# Altium schematic sheet Sheet_CL-IR-01.SchDoc: Inverter / Rectifier
size A4; Author: Canaan Lv; DocumentNumber: CL-IR-01; Revision: 1.0v
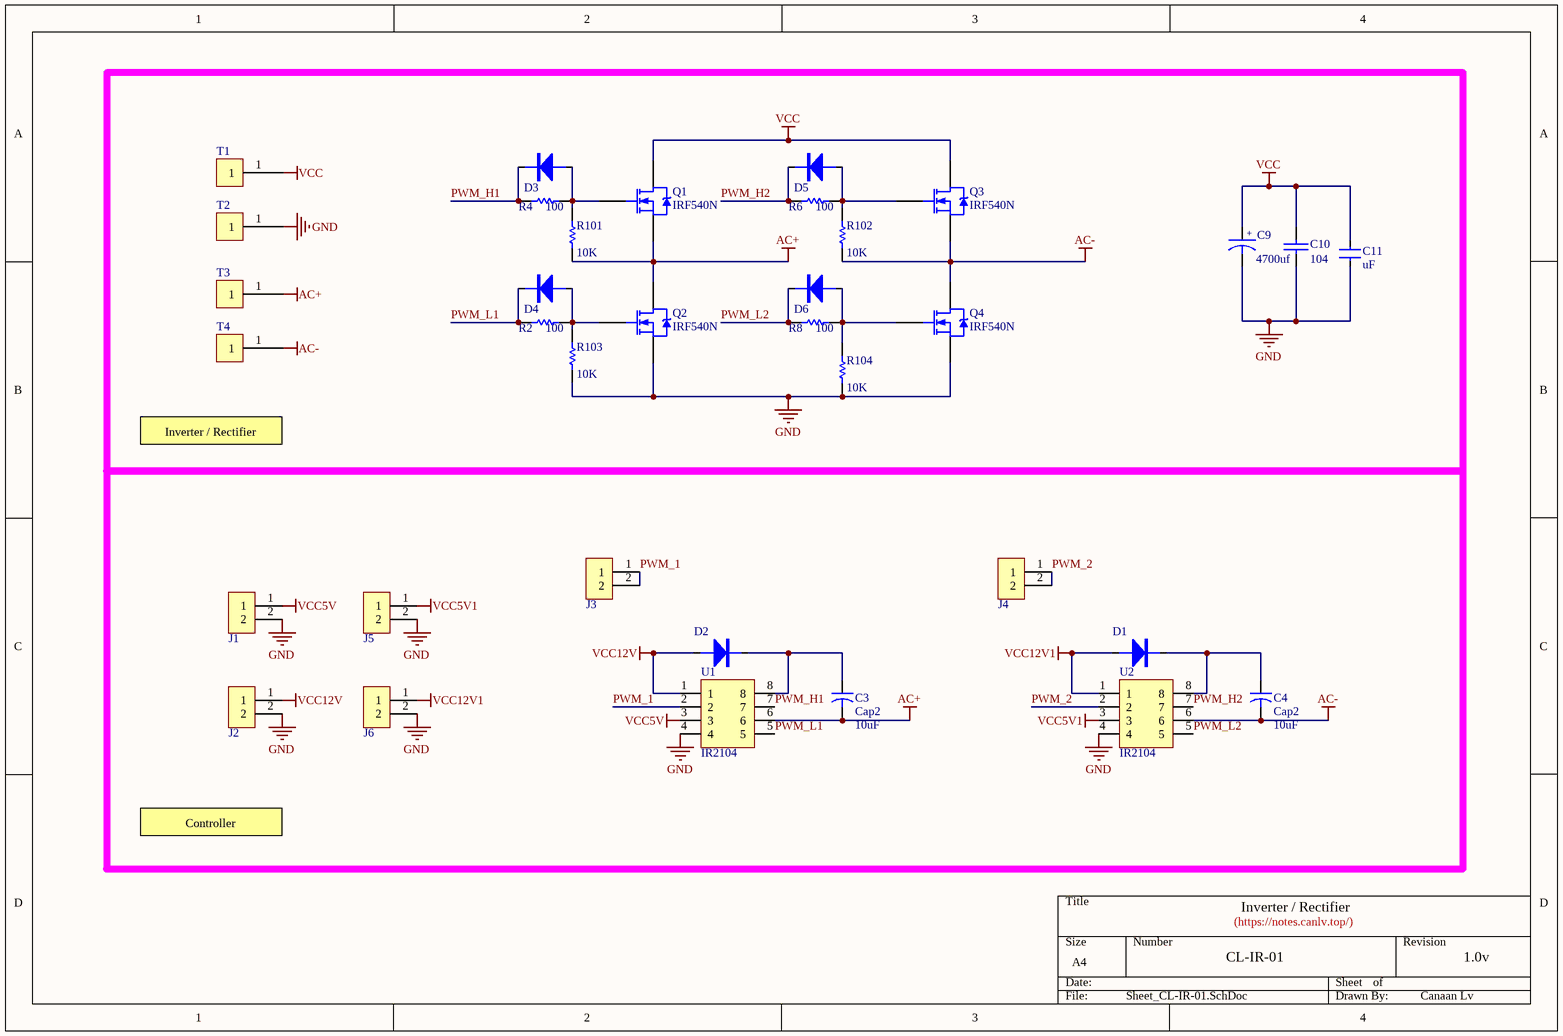
[diagram p0: Sheet_CL-IR-01.SchDoc]

## Parts
C3  Cap2  value 10uF  [CZ0.50/25V47U]
C4  Cap2  value 10uF  [CZ0.50/25V47U]
C9  电解电容  [CZ16X25]  (value not drawn)
C10  普通电容  [C1206]  (value not drawn)
C11  uF  [C0.254]
D1  DO-41  [DO-41-2]  (value not drawn)
D2  DO-41  [DO-41-2]  (value not drawn)
D3  0805D  [0805D]  (value not drawn)
D4  0805D  [0805D]  (value not drawn)
D5  0805D  [0805D]  (value not drawn)
D6  0805D  [0805D]  (value not drawn)
J1  SIP-2  [2.54XH接插件2P]  (value not drawn)
J2  SIP-2  [2.54XH接插件2P]  (value not drawn)
J3  SIP-2  [2.54XH接插件2P]  (value not drawn)
J4  SIP-2  [2.54XH接插件2P]  (value not drawn)
J5  SIP-2  [2.54XH接插件2P]  (value not drawn)
J6  SIP-2  [2.54XH接插件2P]  (value not drawn)
Q1  IRF540N  [TO-220AB]
Q2  IRF540N  [TO-220AB]
Q3  IRF540N  [TO-220AB]
Q4  IRF540N  [TO-220AB]
R2  value 100  [R1206]
R4  value 100  [R1206]
R6  value 100  [R1206]
R8  value 100  [R1206]
R101  value 10K  [R1206]
R102  value 10K  [R1206]
R103  value 10K  [R1206]
R104  value 10K  [R1206]
T1  (no value)  [香蕉接线柱Red_6mm]
T2  (no value)  [香蕉接线柱Red_6mm]
T3  (no value)  [香蕉接线柱Red_6mm]
T4  (no value)  [香蕉接线柱Red_6mm]
U1  IR2104  [SOP8]
U2  IR2104  [SOP8]

## Nets
AC+: C3.2 Q1.3(S) Q2.2(D) R101.1 T3.1 U1.6
AC-: C4.2 Q3.3(S) Q4.2(D) R102.1 T4.1 U2.6
GND: C9.2 C10.2 C11.2 J1.2 J2.2 J5.2 J6.2 Q2.3(S) Q4.3(S) R103.2 R104.2 T2.1 U1.4 U2.4
VCC: C9.1 C10.1 C11.1 Q1.2(D) Q3.2(D) T1.1
VCC5V: J1.1 U1.3
VCC5V1: J5.1 U2.3
VCC12V: D2.A J2.1 U1.1
VCC12V1: D1.A J6.1 U2.1
PWM_1: J3.1 J3.2 U1.2
PWM_2: J4.1 J4.2 U2.2
PWM_H1: D3.K R4.1 U1.7
PWM_H2: D5.K R6.1 U2.7
PWM_L1: D4.K R2.1 U1.5
PWM_L2: D6.K R8.1 U2.5
NetC3_1: C3.1 D2.K U1.8
NetC4_1: C4.1 D1.K U2.8
NetD3_A: D3.A Q1.1(G) R4.2 R101.2
NetD4_A: D4.A Q2.1(G) R2.2 R103.1
NetD5_A: D5.A Q3.1(G) R6.2 R102.2
NetD6_A: D6.A Q4.1(G) R8.2 R104.1

## Notes on the sheet
- Inverter / Rectifier
- Controller
- (https://notes.canlv.top/)
- (in symbol 普通电容) 104
- (in symbol 电解电容) +; 4700uf

## Library data of the parts
C3 C4 = Cap2: Capacitor; Published: 23-Sep-2002; PackageReference: CAPR5-4X5; Publisher: Altium Limited; PackageDescription: Capacitor; 2 Leads
C9 = 电解电容: Capacitor
C10 = 普通电容: Capacitor
C11 = C直插无极性
Q1-Q4 = IRF540N: HEXFET Power MOSFET; Note: Pin 2 is electrically connected to pin 4.; Sim Note: Thermal Model provided is not called on from main Subckt.; Published: 8-Jun-2000; LatestRevisionDate: 17-Jul-2002; LatestRevisionNote: Re-released for DXP Platform.; DatasheetVersion: May-1998; PackageVersion: Feb-1997; PackageReference: TO-220AB; Publisher: Altium Limited; PackageDescription: TO, Thru-Hole, Vertical, Heatsink Mounted; 3 In-Line Leads; Pitch 2.54 mm; ComponentLink1Description: Manufacturer Link; ComponentLink1URL: http://www.irf.com/; ComponentLink2Description: Datasheet; ComponentLink2URL: http://www.irf.com/product-info/datasheets/data/irf540n.pdf
R2 R4 R6 R8 R101-R104 = Res1: Resistor; Published: 8-Jun-2000; LatestRevisionDate: 17-Jul-2002; LatestRevisionNote: Re-released for DXP Platform.; PackageReference: AXIAL-0.3; Publisher: Altium Limited; PackageDescription: Axial Device, Thru-Hole; 2 Leads; 0.3 in Pin Spacing
T1-T4 = TEST_I
U1 U2 = Component_1